# Altium schematic sheet Connectors.SchDoc
size A4
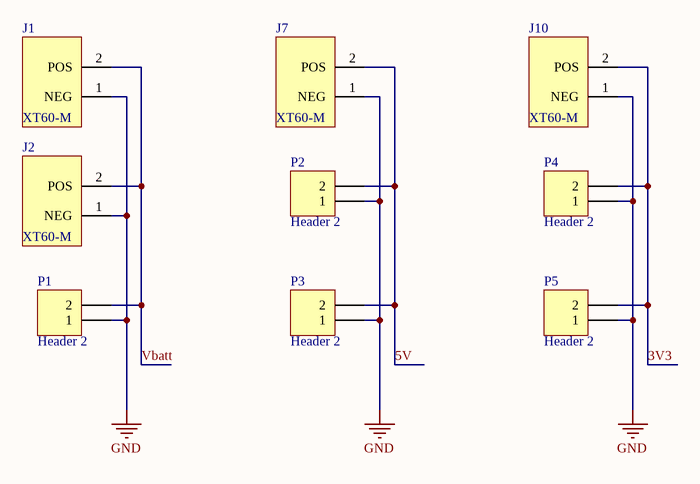
[diagram p0: Connectors.SchDoc]

## Parts
J1  XT60-M  [*AMASS_XT60-M]
J2  XT60-M  [*AMASS_XT60-M]
J7  XT60-M  [*AMASS_XT60-M]
J10  XT60-M  [*AMASS_XT60-M]
P1  Header 2  [HDR1X2]
P2  Header 2  [HDR1X2]
P3  Header 2  [HDR1X2]
P4  Header 2  [HDR1X2]
P5  Header 2  [HDR1X2]

## Nets
GND: J1.1(NEG) J2.1(NEG) J7.1(NEG) J10.1(NEG) P1.1 P2.1 P3.1 P4.1 P5.1
3V3: J10.2(POS) P4.2 P5.2
5V: J7.2(POS) P2.2 P3.2
Vbatt: J1.2(POS) J2.2(POS) P1.2

## Library data of the parts
J1 J2 J7 J10 = XT60-M: Plug; DC supply; XT60; male; PIN: 2; for cable; soldered; 30A; 500V; MF: AMASS; Availability: Unavailable; Package: Package Analog Devices; MP: XT60-M; Price: None; SnapEDA_Link: https://www.snapeda.com/parts/XT60-M/AMASS/view-part/2883912/?ref=snap; Value: *
P1-P5 = Header 2: Header, 2-Pin; LatestRevisionDate: 17-Jul-2002; LatestRevisionNote: Re-released for DXP Platform.; Publisher: Altium Limited